# Altium schematic sheet peripherals.SchDoc
size A; SheetNumber: 5; SheetTotal: 5
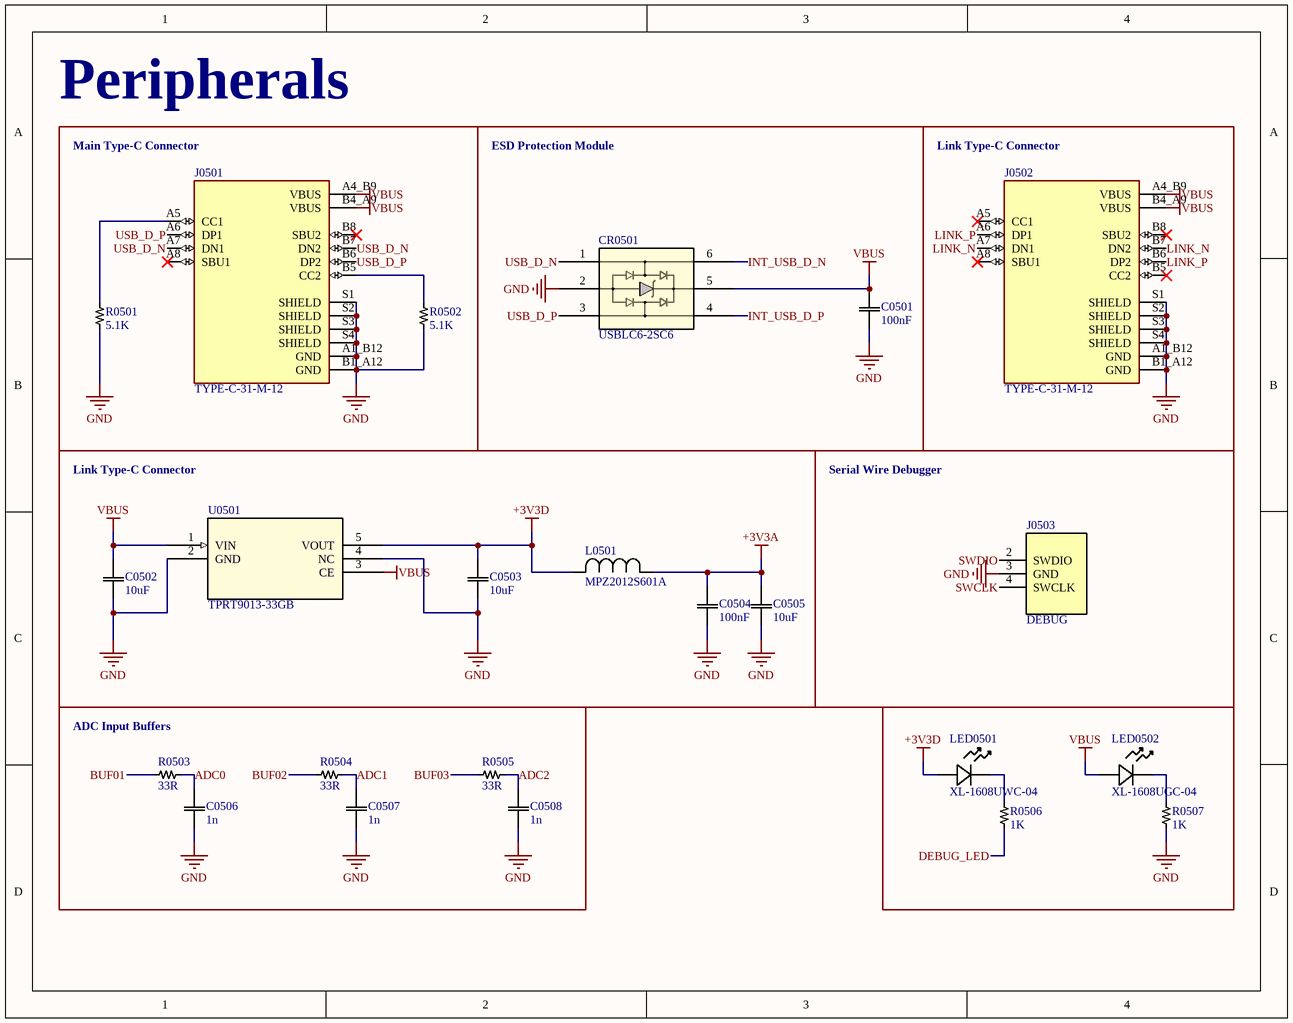
[diagram p0: peripherals.SchDoc]

## Parts
C0501  100nF  [CAPC10555_55N_KEM]
C0502  10uF  [CAPC10555_55N_KEM]
C0503  10uF  [CAPC10555_55N_KEM]
C0504  100nF  [CAPC10555_55N_KEM]
C0505  10uF  [CAPC10555_55N_KEM]
C0506  1n  [CAPC10555_55N_KEM]
C0507  1n  [CAPC10555_55N_KEM]
C0508  1n  [CAPC10555_55N_KEM]
CR0501  USBLC6-2SC6  [SOT23-6L_STM]
J0501  TYPE-C-31-M-12  [HRO_TYPE-C-31-M-12]
J0502  TYPE-C-31-M-12  [HRO_TYPE-C-31-M-12]
J0503  DEBUG  [SW_Debugger_3P]
L0501  MPZ2012S601A  [IND_MPZ2012_TDK]
LED0501  XL-1608UWC-04  [LED_XL-1608_XLG]
LED0502  XL-1608UGC-04  [LED_XL-1608_XLG]
R0501  5.1K  [RES0402_CPF_TYCO_TYC]
R0502  5.1K  [RES0402_CPF_TYCO_TYC]
R0503  33R  [RES0402_CPF_TYCO_TYC]
R0504  33R  [RES0402_CPF_TYCO_TYC]
R0505  33R  [RES0402_CPF_TYCO_TYC]
R0506  1K  [RES0402_CPF_TYCO_TYC]
R0507  1K  [RES0402_CPF_TYCO_TYC]
U0501  TPRT9013-33GB  [SOT23-5_TCP]

## Blocks framed on the sheet
Peripherals: J0501 R0501 R0502
ESD Protection Module: C0501 CR0501
Link Type-C Connector: J0502
Link Type-C Connector: C0502 C0503 C0504 C0505 L0501 U0501
Serial Wire Debugger: J0503
ADC Input Buffers: C0506 C0507 C0508 R0503 R0504 R0505

## Nets
+3V3A: C0504.2 C0505.2 L0501.1
+3V3D: C0503.2 L0501.2 LED0501.2(ANODE) U0501.5(VOUT)
GND: C0501.1 C0502.1 C0503.1 C0504.1 C0505.1 C0506.1 C0507.1 C0508.1 CR0501.2 J0501.A1_B12(GND) J0501.B1_A12(GND) J0501.S1(SHIELD) J0501.S2(SHIELD) J0501.S3(SHIELD) J0501.S4(SHIELD) J0502.A1_B12(GND) J0502.B1_A12(GND) J0502.S1(SHIELD) J0502.S2(SHIELD) J0502.S3(SHIELD) J0502.S4(SHIELD) J0503.3(GND) R0501.1 R0502.1 R0507.2 U0501.2(GND) U0501.4(NC)
VBUS: C0501.2 C0502.2 CR0501.5 J0501.A4_B9(VBUS) J0501.B4_A9(VBUS) J0502.A4_B9(VBUS) J0502.B4_A9(VBUS) LED0502.2(ANODE) U0501.1(VIN) U0501.3(CE)
ADC0: C0506.2 R0503.1
ADC1: C0507.2 R0504.1
ADC2: C0508.2 R0505.1
BUF01: R0503.2
BUF02: R0504.2
BUF03: R0505.2
DEBUG_LED: R0506.2
INT_USB_D_N: CR0501.6
INT_USB_D_P: CR0501.4
LINK_N: J0502.A7(DN1) J0502.B7(DN2)
LINK_P: J0502.A6(DP1) J0502.B6(DP2)
SWCLK: J0503.4(SWCLK)
SWDIO: J0503.2(SWDIO)
USB_D_N: CR0501.1 J0501.A7(DN1) J0501.B7(DN2)
USB_D_P: CR0501.3 J0501.A6(DP1) J0501.B6(DP2)
NetJ0501_A5: J0501.A5(CC1) R0501.2
NetJ0501_B5: J0501.B5(CC2) R0502.2
NetLED0501_1: LED0501.1(CATHODE) R0506.1
NetLED0502_1: LED0502.1(CATHODE) R0507.1

Not connected (* = marked no-connect by the designer): J0501 A8(SBU1)* B8(SBU2)*; J0502 A5(CC1)* A8(SBU1)* B5(CC2)* B8(SBU2)*

## Notes on the sheet
- (near J0501) Main Type-C Connector

## Library data of the parts
C0501 C0502 C0503 C0504 C0505 C0506 C0507 C0508 = C0402: SMD Comm X7R, Ceramic, SMD, MLCC, Temperature Stable, 0402; Manufacturer_Name: Kemet; Manufacturer_Part_Number: C0402C104K4RACTU; Copyright: Copyright (C) 2025 Ultra Librarian. All rights reserved.; Datasheet: https://content.kemet.com/datasheets/KEM_C1002_X7R_SMD.pdf
CR0501 = USBLC6-2SC6: ESD Protection for USB 2.0 High Speed; Manufacturer_Name: STMicroelectronics; Copyright: Copyright (C) 2025 Ultra Librarian. All rights reserved.; Manufacturer_Part_Number: USBLC6-2SC6; Datasheet: https://www.st.com/resource/en/datasheet/usblc6-2.pdf; RefDes: RefDes; Type: Type
J0501 J0502 = TYPE-C-31-M-12: USB Connectors 24 Receptacle 1 8.94*7.3mm RoHS; MF: HRO Electronics Co., Ltd.; SnapEDA_Link: https://www.snapeda.com/parts/TYPE-C-31-M-12/HRO+Electronics+Co.%252C+Ltd./view-part/?ref=snap; Package: Package; Value: *; MP: TYPE-C-31-M-12; Check_prices: https://www.snapeda.com/parts/TYPE-C-31-M-12/HRO+Electronics+Co.%252C+Ltd./view-part/?ref=eda
J0503 = DEBUG: Back up plan for serial wire debugging
L0501 = MPZ2012S601A: No Description Available; Manufacturer_Name: TDK; Copyright: Copyright (C) 2025 Ultra Librarian. All rights reserved.; Manufacturer_Part_Number: MPZ2012S601A
LED0501 LED0502 = XL-1608UWC-04: No Description Available; Manufacturer_Name: XINGLIGHT; Copyright: Copyright (C) 2025 Ultra Librarian. All rights reserved.; Manufacturer_Part_Number: XL-1608UWC-04
R0501 R0502 R0503 R0504 R0505 R0506 R0507 = R0402: CPF 0402 RL; Manufacturer_Name: TE Connectivity; Manufacturer_Part_Number: CPF0402B33RE1; Copyright: Copyright (C) 2025 Ultra Librarian. All rights reserved.; Datasheet: https://www.te.com/commerce/DocumentDelivery/DDEController?Action=srchrtrv&DocNm=1773200&DocType=Data+Sheet&DocLang=English&PartCntxt=1-1879208-3&DocFormat=pdf
U0501 = TPRT9013-33GB: No Description Available; Manufacturer_Name: Tech Public; Type: Power Management; Copyright: Copyright (C) 2025 Ultra Librarian. All rights reserved.; Manufacturer_Part_Number: TPRT9013-33GB; RefDes: RefDes